# EAGLE design 406_led_jetracer_matrix (EAGLE 9.6.2)
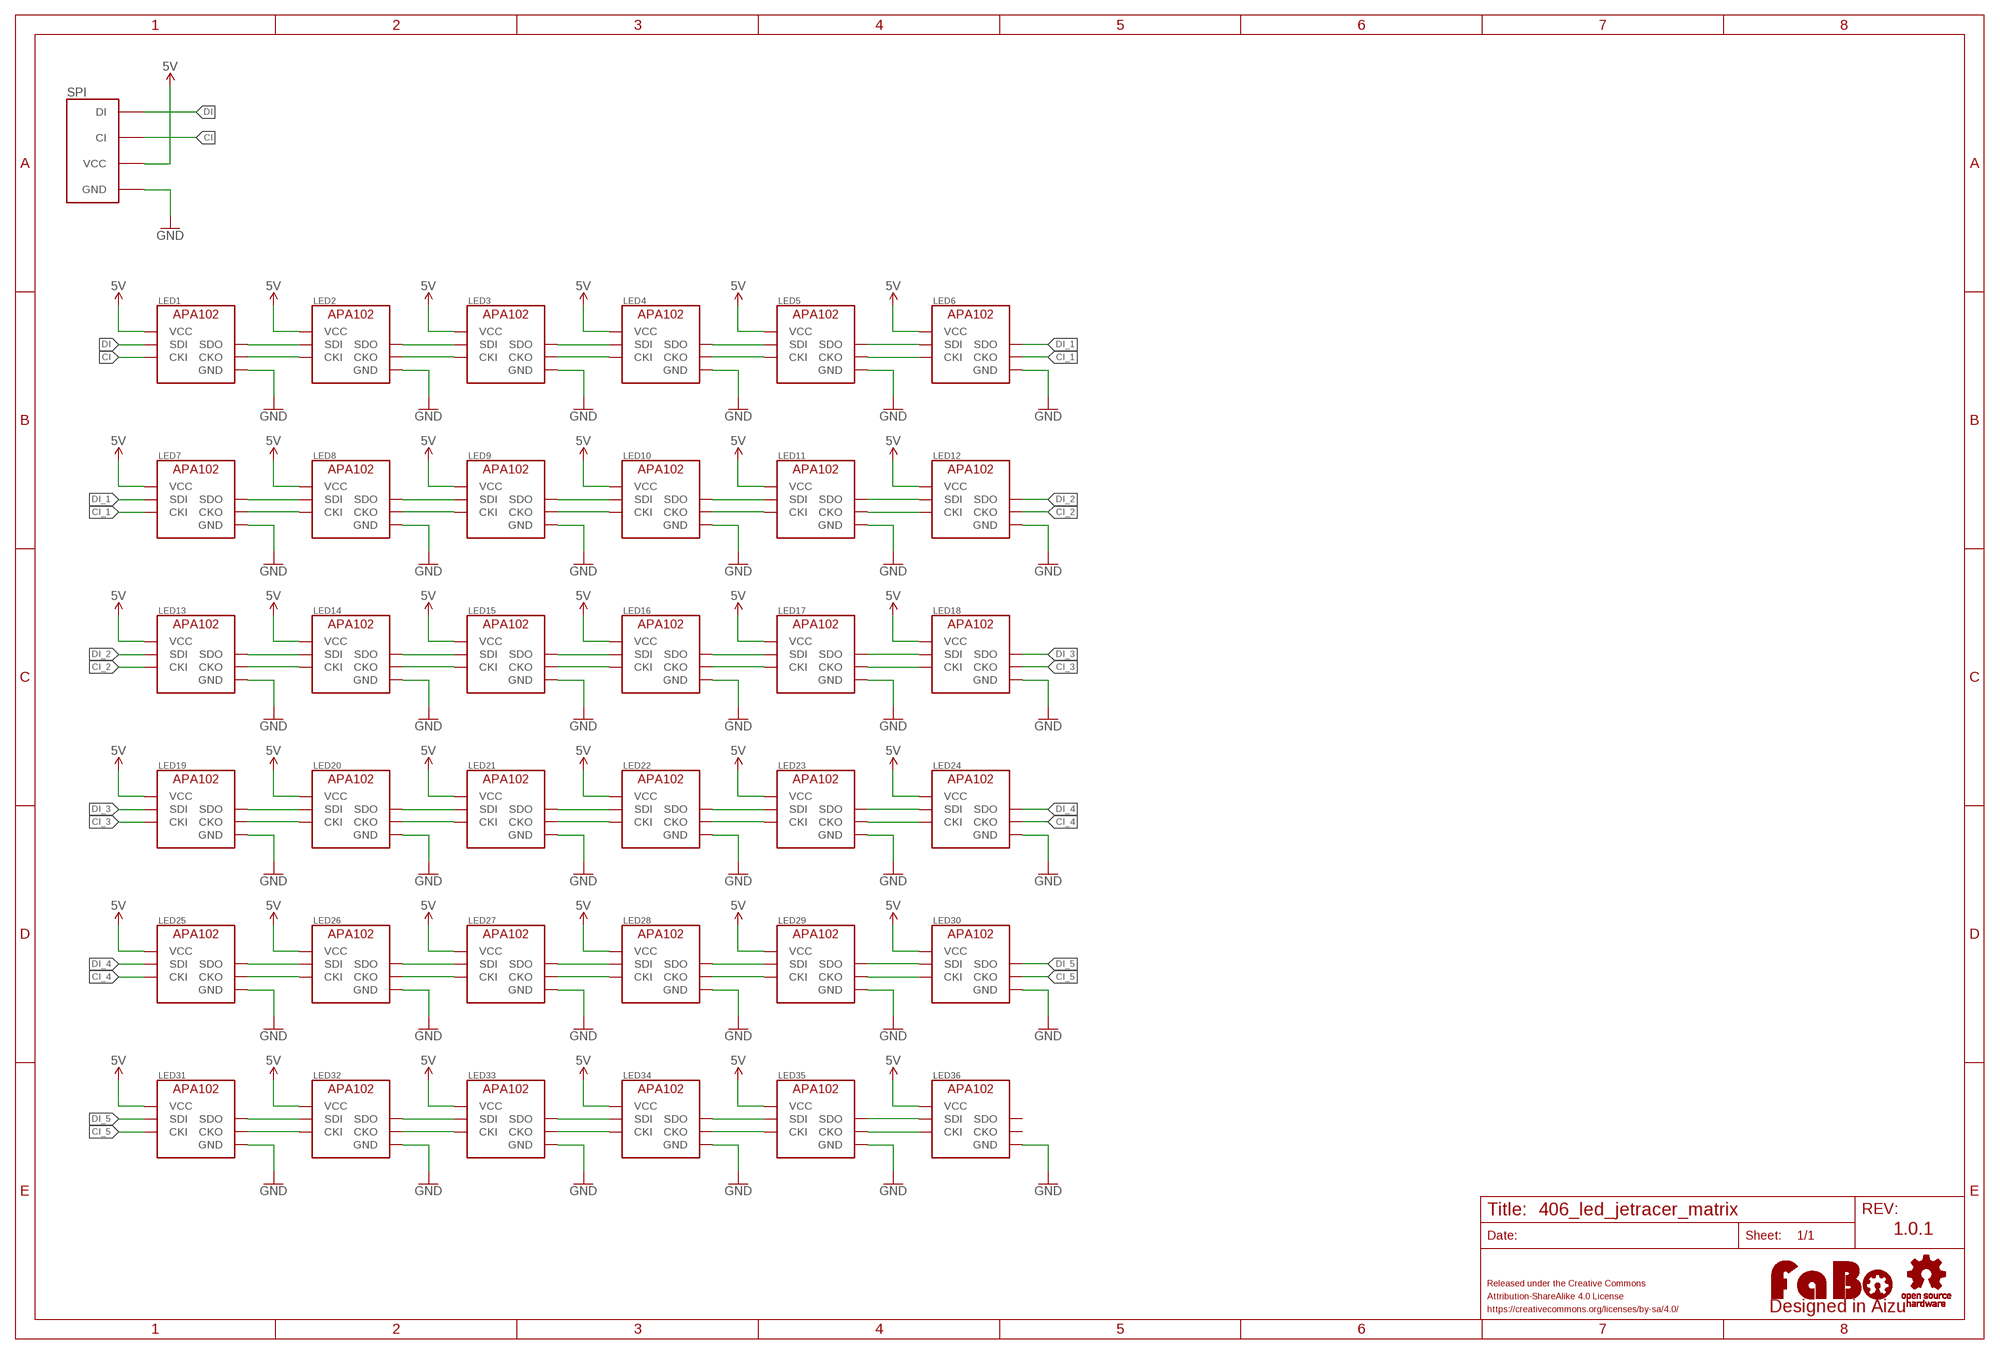
[diagram p0: schematic, sheet 1]

## Parts
LED1  APA102_IPIXEL  [APA102_2020]
LED2  APA102_IPIXEL  [APA102_2020]
LED3  APA102_IPIXEL  [APA102_2020]
LED4  APA102_IPIXEL  [APA102_2020]
LED5  APA102_IPIXEL  [APA102_2020]
LED6  APA102_IPIXEL  [APA102_2020]
LED7  APA102_IPIXEL  [APA102_2020]
LED8  APA102_IPIXEL  [APA102_2020]
LED9  APA102_IPIXEL  [APA102_2020]
LED10  APA102_IPIXEL  [APA102_2020]
LED11  APA102_IPIXEL  [APA102_2020]
LED12  APA102_IPIXEL  [APA102_2020]
LED13  APA102_IPIXEL  [APA102_2020]
LED14  APA102_IPIXEL  [APA102_2020]
LED15  APA102_IPIXEL  [APA102_2020]
LED16  APA102_IPIXEL  [APA102_2020]
LED17  APA102_IPIXEL  [APA102_2020]
LED18  APA102_IPIXEL  [APA102_2020]
LED19  APA102_IPIXEL  [APA102_2020]
LED20  APA102_IPIXEL  [APA102_2020]
LED21  APA102_IPIXEL  [APA102_2020]
LED22  APA102_IPIXEL  [APA102_2020]
LED23  APA102_IPIXEL  [APA102_2020]
LED24  APA102_IPIXEL  [APA102_2020]
LED25  APA102_IPIXEL  [APA102_2020]
LED26  APA102_IPIXEL  [APA102_2020]
LED27  APA102_IPIXEL  [APA102_2020]
LED28  APA102_IPIXEL  [APA102_2020]
LED29  APA102_IPIXEL  [APA102_2020]
LED30  APA102_IPIXEL  [APA102_2020]
LED31  APA102_IPIXEL  [APA102_2020]
LED32  APA102_IPIXEL  [APA102_2020]
LED33  APA102_IPIXEL  [APA102_2020]
LED34  APA102_IPIXEL  [APA102_2020]
LED35  APA102_IPIXEL  [APA102_2020]
LED36  APA102_IPIXEL  [APA102_2020]
LOGO1  LOGO_OSHW-M_BOTTOM  [LOGO_OSHW_M_BOTTOM]
LOGO2  LOGO_FABO-M_BOTTOM  [LOGO_FABO_M_BOTTOM]
SPI  FABO-SPI-LED-B04B-BOTTOM  [SPI-B04-PASK-1-BOTTOM]

## Nets
5V: LED1.VCC LED2.VCC LED3.VCC LED4.VCC LED5.VCC LED6.VCC LED7.VCC LED8.VCC LED9.VCC LED10.VCC LED11.VCC LED12.VCC LED13.VCC LED14.VCC LED15.VCC LED16.VCC LED17.VCC LED18.VCC LED19.VCC LED20.VCC LED21.VCC LED22.VCC LED23.VCC LED24.VCC LED25.VCC LED26.VCC LED27.VCC LED28.VCC LED29.VCC LED30.VCC LED31.VCC LED32.VCC LED33.VCC LED34.VCC LED35.VCC LED36.VCC SPI.VCC
CI: LED1.CKI SPI.CI
CI1: LED1.CKO LED2.CKI
CI2: LED2.CKO LED3.CKI
CI3: LED3.CKO LED4.CKI
CI4: LED4.CKO LED5.CKI
CI5: LED5.CKO LED6.CKI
CI6: LED11.CKO LED12.CKI
CI7: LED10.CKO LED11.CKI
CI8: LED9.CKO LED10.CKI
CI9: LED8.CKO LED9.CKI
CI10: LED7.CKO LED8.CKI
CI11: LED17.CKO LED18.CKI
CI12: LED16.CKO LED17.CKI
CI13: LED15.CKO LED16.CKI
CI14: LED14.CKO LED15.CKI
CI15: LED13.CKO LED14.CKI
CI16: LED23.CKO LED24.CKI
CI17: LED22.CKO LED23.CKI
CI18: LED21.CKO LED22.CKI
CI19: LED20.CKO LED21.CKI
CI20: LED19.CKO LED20.CKI
CI21: LED29.CKO LED30.CKI
CI22: LED28.CKO LED29.CKI
CI23: LED27.CKO LED28.CKI
CI24: LED26.CKO LED27.CKI
CI25: LED25.CKO LED26.CKI
CI26: LED35.CKO LED36.CKI
CI27: LED34.CKO LED35.CKI
CI28: LED33.CKO LED34.CKI
CI29: LED32.CKO LED33.CKI
CI30: LED31.CKO LED32.CKI
CI_1: LED6.CKO LED7.CKI
CI_2: LED12.CKO LED13.CKI
CI_3: LED18.CKO LED19.CKI
CI_4: LED24.CKO LED25.CKI
CI_5: LED30.CKO LED31.CKI
DI: LED1.SDI SPI.DI
DI1: LED1.SDO LED2.SDI
DI2: LED2.SDO LED3.SDI
DI3: LED3.SDO LED4.SDI
DI4: LED4.SDO LED5.SDI
DI5: LED5.SDO LED6.SDI
DI6: LED11.SDO LED12.SDI
DI7: LED10.SDO LED11.SDI
DI8: LED9.SDO LED10.SDI
DI9: LED8.SDO LED9.SDI
DI10: LED7.SDO LED8.SDI
DI11: LED17.SDO LED18.SDI
DI12: LED16.SDO LED17.SDI
DI13: LED15.SDO LED16.SDI
DI14: LED14.SDO LED15.SDI
DI15: LED13.SDO LED14.SDI
DI16: LED23.SDO LED24.SDI
DI17: LED22.SDO LED23.SDI
DI18: LED21.SDO LED22.SDI
DI19: LED20.SDO LED21.SDI
DI20: LED19.SDO LED20.SDI
DI21: LED29.SDO LED30.SDI
DI22: LED28.SDO LED29.SDI
DI23: LED27.SDO LED28.SDI
DI24: LED26.SDO LED27.SDI
DI25: LED25.SDO LED26.SDI
DI26: LED35.SDO LED36.SDI
DI27: LED34.SDO LED35.SDI
DI28: LED33.SDO LED34.SDI
DI29: LED32.SDO LED33.SDI
DI30: LED31.SDO LED32.SDI
DI_1: LED6.SDO LED7.SDI
DI_2: LED12.SDO LED13.SDI
DI_3: LED18.SDO LED19.SDI
DI_4: LED24.SDO LED25.SDI
DI_5: LED30.SDO LED31.SDI
GND: LED1.GND LED2.GND LED3.GND LED4.GND LED5.GND LED6.GND LED7.GND LED8.GND LED9.GND LED10.GND LED11.GND LED12.GND LED13.GND LED14.GND LED15.GND LED16.GND LED17.GND LED18.GND LED19.GND LED20.GND LED21.GND LED22.GND LED23.GND LED24.GND LED25.GND LED26.GND LED27.GND LED28.GND LED29.GND LED30.GND LED31.GND LED32.GND LED33.GND LED34.GND LED35.GND LED36.GND SPI.GND
Unconnected: LED36.CKO LED36.SDO

## Notes on the sheet
- 1.0.1

## Library data of the parts
LED1-LED36 = FaBo-LED:APA102
LOGO1 = FaBo-Logo:LOGO_OSHW
LOGO2 = FaBo-Logo:LOGO_FABO
SPI = FaBo-Connetor:FABO-SPI-LED

## Net classes
2 gnd: width 0.254 mm, drill 0.61 mm, clearance 0.254 mm
3 usbvcc: width 0.254 mm, drill 0.61 mm, clearance 0.254 mm
4 aref: width 0.254 mm, drill 0.61 mm, clearance 0.254 mm

## Board
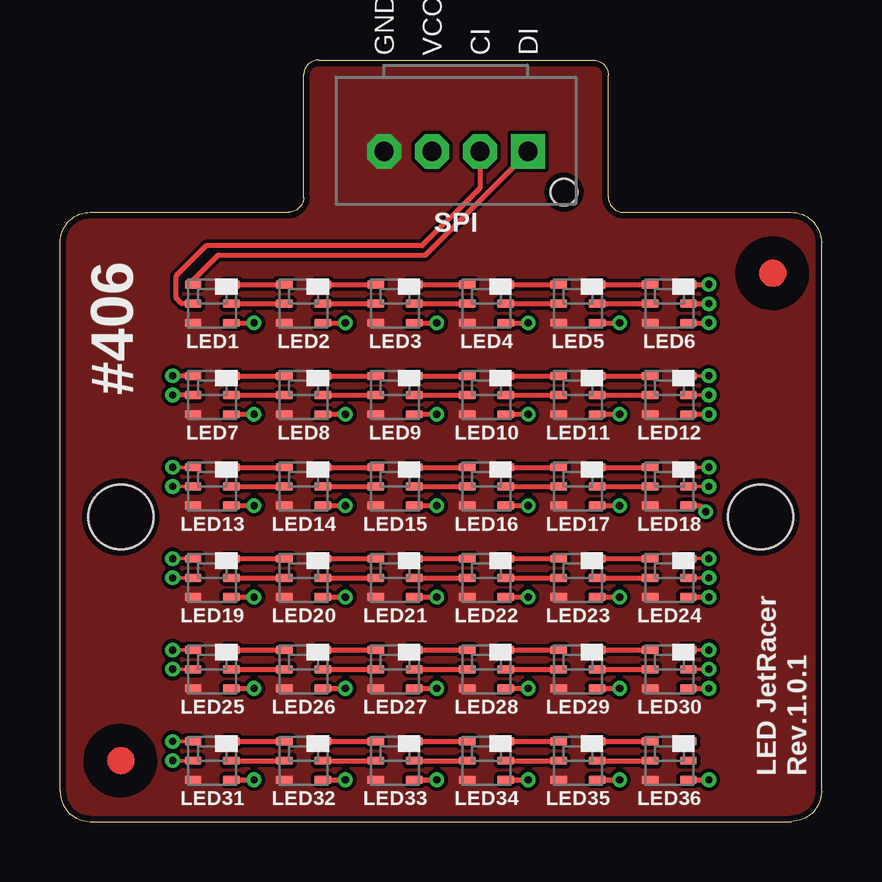
[diagram p1: board, top side]
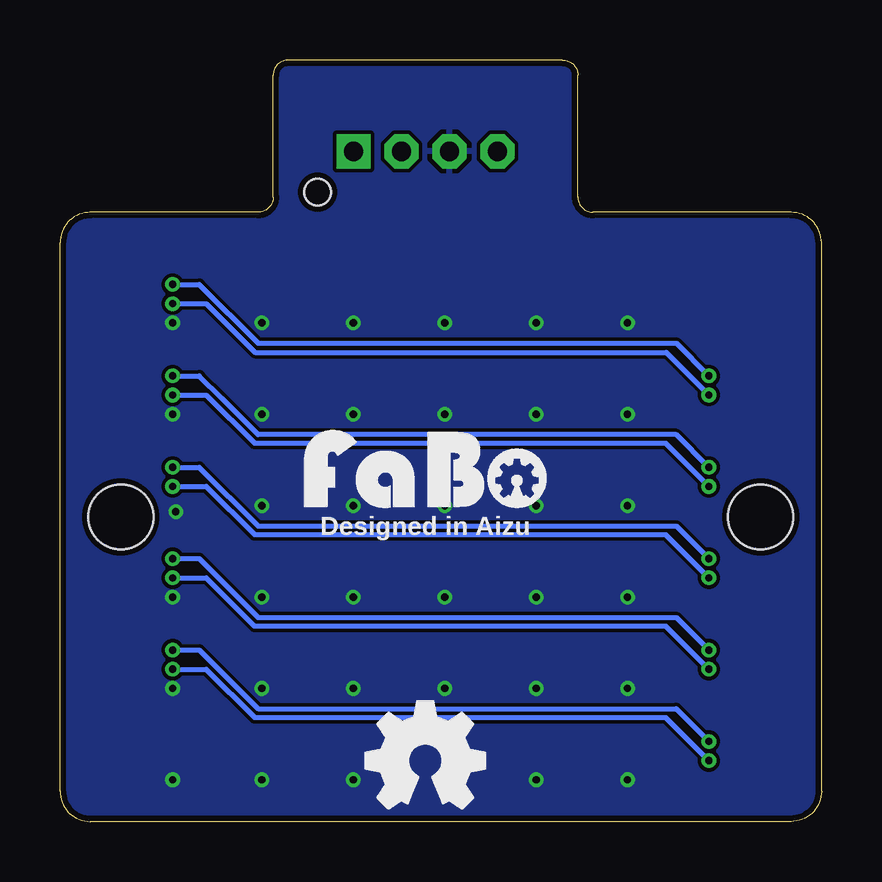
[diagram p2: board, bottom side, seen from below]

Size 31.75 x 31.75 mm. Coordinates in mm from the lower left corner, seen from the top.
Outline: 1.27,25.4 9.53,25.4 arc90 10.16,26.04 10.16,31.11 arc-90 10.79,31.75 22.23,31.75 arc-90 22.86,31.11 22.86,26.04 arc90 23.5,25.4 30.48,25.4 arc-90 31.75,24.13 31.75,1.27 arc-90 30.48,0 1.27,0 arc-90 0,1.27 0,24.13 arc-90 1.27,25.4
Copper layers (1*16): Top 0.035mm / dielectric 1.6mm / Bottom 0.035mm
Design rules "PCBway": minimum track width 6mil, minimum drill 12mil, track to track 6mil, track to pad 6mil, pad to pad 6mil, via to via 6mil, smd to smd 6mil, copper to edge 10mil, drill to drill 10mil, minimum pad ring 10mil, minimum via ring 6mil, stop-mask expansion 2mil, vias tented up to drill 100mil, thermal gap 8mil
Holes 2.7 mm at 2.54,12.7 29.21,12.7

### Footprints (pad centres in the part's own frame; a part is rotated, then mirrored left to right if it is on the bottom)
APA102_2020 = smd 0.7 x 0.35: CKI 0.8,0; CKO -0.8,0; GND 0.8,0.8; SDI 0.8,-0.8; SDO -0.8,-0.8; VCC -0.8,0.8
SPI-B04-PASK-1-BOTTOM = drill 0.8 pad 1.422 octagon: CI -1,0; GND 3,0; VCC 1,0 | drill 0.8 pad 1.422 square: DI -3,0 | hole 1.1: -4.5,1.7

### Placement (x,y rotation side)
LED1  6.35,21.59 180 top
LED2  10.16,21.59 180 top
LED3  13.97,21.59 180 top
LED4  17.78,21.59 180 top
LED5  21.59,21.59 180 top
LED6  25.4,21.59 180 top
LED7  6.35,17.78 180 top
LED8  10.16,17.78 180 top
LED9  13.97,17.78 180 top
LED10  17.78,17.78 180 top
LED11  21.59,17.78 180 top
LED12  25.4,17.78 180 top
LED13  6.35,13.97 180 top
LED14  10.16,13.97 180 top
LED15  13.97,13.97 180 top
LED16  17.78,13.97 180 top
LED17  21.59,13.97 180 top
LED18  25.4,13.97 180 top
LED19  6.35,10.16 180 top
LED20  10.16,10.16 180 top
LED21  13.97,10.16 180 top
LED22  17.78,10.16 180 top
LED23  21.59,10.16 180 top
LED24  25.4,10.16 180 top
LED25  6.35,6.35 180 top
LED26  10.16,6.35 180 top
LED27  13.97,6.35 180 top
LED28  17.78,6.35 180 top
LED29  21.59,6.35 180 top
LED30  25.4,6.35 180 top
LED31  6.35,2.54 180 top
LED32  10.16,2.54 180 top
LED33  13.97,2.54 180 top
LED34  17.78,2.54 180 top
LED35  21.59,2.54 180 top
LED36  25.4,2.54 180 top
LOGO1  16.51,2.54 0 top
LOGO2  16.51,12.7 0 top
SPI  16.51,27.94 180 top
U$2  [MARK_POINT_3MM]  29.72,22.86 0 top
U$3  [MARK_POINT_3MM]  2.54,2.54 0 top

### Tracks (layer width: path | path; a pad name or v marks a point on that pad's centre or on a via)
5V  (via drill 0.3)
  Top 0.203: LED1.VCC v8.09,20.79 | LED2.VCC v11.9,20.79 | LED3.VCC v15.71,20.79 | LED4.VCC v19.52,20.79 | LED5.VCC v23.33,20.79 | LED7.VCC v8.09,16.98 | LED8.VCC v11.9,16.98 | LED9.VCC v15.71,16.98 | LED10.VCC v19.52,16.98 | LED11.VCC v23.33,16.98 | LED12.VCC v27.05,16.98 | LED13.VCC v8.09,13.17 | LED14.VCC v11.9,13.17 | LED15.VCC v15.71,13.17 | LED16.VCC v19.52,13.17 | LED17.VCC v23.33,13.17 | LED19.VCC v8.09,9.36 | LED20.VCC v11.9,9.36 | LED21.VCC v15.71,9.36 | LED22.VCC v19.52,9.36 | LED23.VCC v23.33,9.36 | LED24.VCC v27.05,9.36 | LED25.VCC v8.09,5.55 | LED26.VCC v11.9,5.55 | LED27.VCC v15.71,5.55 | LED28.VCC v19.52,5.55 | LED29.VCC v23.33,5.55 | LED30.VCC v27.05,5.55 | LED31.VCC v8.09,1.74 | LED32.VCC v11.9,1.74 | LED33.VCC v15.71,1.74 | LED34.VCC v19.52,1.74 | LED35.VCC v23.33,1.74 | LED36.VCC v27.05,1.74 | LED18.VCC 26.67,13.17 v26.92,12.92 | LED6.VCC v27.05,20.79
  pour Bottom (isolate 0.152, rank 3): 0,0 0,31.75 31.75,31.75 31.75,0
CI
  Top 0.203: SPI.CI 17.51,26.42 15.1,24 6.1,24 4.83,22.73 4.83,21.84 5.08,21.59 LED1.CKI
CI1
  Top 0.203: LED1.CKO LED2.CKI
CI2
  Top 0.203: LED2.CKO LED3.CKI
CI3
  Top 0.203: LED3.CKO LED4.CKI
CI4
  Top 0.203: LED4.CKO LED5.CKI
CI5
  Top 0.203: LED5.CKO LED6.CKI
CI6
  Top 0.203: LED11.CKO LED12.CKI
CI7
  Top 0.203: LED10.CKO LED11.CKI
CI8
  Top 0.203: LED9.CKO LED10.CKI
CI9
  Top 0.203: LED8.CKO LED9.CKI
CI10
  Top 0.203: LED7.CKO LED8.CKI
CI11
  Top 0.203: LED17.CKO LED18.CKI
CI12
  Top 0.203: LED16.CKO LED17.CKI
CI13
  Top 0.203: LED15.CKO LED16.CKI
CI14
  Top 0.203: LED14.CKO LED15.CKI
CI15
  Top 0.203: LED13.CKO LED14.CKI
CI16
  Top 0.203: LED23.CKO LED24.CKI
CI17
  Top 0.203: LED22.CKO LED23.CKI
CI18
  Top 0.203: LED21.CKO LED22.CKI
CI19
  Top 0.203: LED20.CKO LED21.CKI
CI20
  Top 0.203: LED19.CKO LED20.CKI
CI21
  Top 0.203: LED29.CKO LED30.CKI
CI22
  Top 0.203: LED28.CKO LED29.CKI
CI23
  Top 0.203: LED27.CKO LED28.CKI
CI24
  Top 0.203: LED26.CKO LED27.CKI
CI25
  Top 0.203: LED25.CKO LED26.CKI
CI26
  Top 0.203: LED35.CKO LED36.CKI
CI27
  Top 0.203: LED34.CKO LED35.CKI
CI28
  Top 0.203: LED33.CKO LED34.CKI
CI29
  Top 0.203: LED32.CKO LED33.CKI
CI30
  Top 0.203: LED31.CKO LED32.CKI
CI_1  (via drill 0.3)
  Top 0.203: LED6.CKO v27.05,21.59 | LED7.CKI v4.7,17.78
  Bottom 0.203: v4.7,17.78 6.48,19.56 23.62,19.56 25.65,21.59 v27.05,21.59
CI_2  (via drill 0.3)
  Top 0.152: LED12.CKO v27.05,17.78 | LED13.CKI v4.7,13.97
  Bottom 0.203: v4.7,13.97 6.5,15.77 23.64,15.77 25.65,17.78 v27.05,17.78
CI_3  (via drill 0.3)
  Top 0.152: LED18.CKO v27.05,13.97 | LED19.CKI v4.7,10.16
  Bottom 0.203: v4.7,10.16 6.5,11.96 23.64,11.96 25.65,13.97 v27.05,13.97
CI_4  (via drill 0.3)
  Top 0.152: LED24.CKO v27.05,10.16 | LED25.CKI v4.7,6.35
  Bottom 0.203: v4.7,6.35 6.5,8.15 23.65,8.15 25.65,10.16 v27.05,10.16
CI_5  (via drill 0.3)
  Top 0.152: LED30.CKO v27.05,6.35 | LED31.CKI v4.7,2.54
  Bottom 0.203: v4.7,2.54 6.5,4.34 23.64,4.34 25.65,6.35 v27.05,6.35
DI
  Top 0.203: SPI.DI 19.51,27.89 15.24,23.62 6.6,23.62 5.55,22.57 LED1.SDI
DI1
  Top 0.203: LED1.SDO LED2.SDI
DI2
  Top 0.203: LED2.SDO LED3.SDI
DI3
  Top 0.203: LED3.SDO LED4.SDI
DI4
  Top 0.203: LED4.SDO LED5.SDI
DI5
  Top 0.203: LED5.SDO LED6.SDI
DI6
  Top 0.203: LED11.SDO LED12.SDI
DI7
  Top 0.203: LED10.SDO LED11.SDI
DI8
  Top 0.203: LED9.SDO LED10.SDI
DI9
  Top 0.203: LED8.SDO LED9.SDI
DI10
  Top 0.203: LED7.SDO LED8.SDI
DI11
  Top 0.203: LED17.SDO LED18.SDI
DI12
  Top 0.203: LED16.SDO LED17.SDI
DI13
  Top 0.203: LED15.SDO LED16.SDI
DI14
  Top 0.203: LED14.SDO LED15.SDI
DI15
  Top 0.203: LED13.SDO LED14.SDI
DI16
  Top 0.203: LED23.SDO LED24.SDI
DI17
  Top 0.203: LED22.SDO LED23.SDI
DI18
  Top 0.203: LED21.SDO LED22.SDI
DI19
  Top 0.203: LED20.SDO LED21.SDI
DI20
  Top 0.203: LED19.SDO LED20.SDI
DI21
  Top 0.203: LED29.SDO LED30.SDI
DI22
  Top 0.203: LED28.SDO LED29.SDI
DI23
  Top 0.203: LED27.SDO LED28.SDI
DI24
  Top 0.203: LED26.SDO LED27.SDI
DI25
  Top 0.203: LED25.SDO LED26.SDI
DI26
  Top 0.203: LED35.SDO LED36.SDI
DI27
  Top 0.203: LED34.SDO LED35.SDI
DI28
  Top 0.203: LED33.SDO LED34.SDI
DI29
  Top 0.203: LED32.SDO LED33.SDI
DI30
  Top 0.203: LED31.SDO LED32.SDI
DI_1  (via drill 0.3)
  Top 0.203: LED6.SDO v27.05,22.39 | LED7.SDI v4.7,18.58
  Bottom 0.203: v4.7,18.58 6.06,19.94 23.5,19.94 25.95,22.39 v27.05,22.39
DI_2  (via drill 0.3)
  Top 0.152: LED12.SDO v27.05,18.58 | LED13.SDI v4.7,14.77
  Bottom 0.203: v4.7,14.77 6.06,16.13 23.5,16.13 24.96,17.59 25.02,17.65 25.95,18.58 v27.05,18.58
DI_3  (via drill 0.3)
  Top 0.152: LED18.SDO v27.05,14.77 | LED19.SDI v4.7,10.96
  Bottom 0.203: v4.7,10.96 6.06,12.32 23.5,12.32 25.95,14.77 v27.05,14.77
DI_4  (via drill 0.3)
  Top 0.152: LED24.SDO v27.05,10.96 | LED25.SDI v4.7,7.15
  Bottom 0.203: v4.7,7.15 6.06,8.51 23.5,8.51 25.95,10.96 v27.05,10.96
DI_5  (via drill 0.3)
  Top 0.152: LED30.SDO v27.05,7.15 | LED31.SDI v4.7,3.34
  Bottom 0.203: v4.7,3.34 6.06,4.7 23.5,4.7 25.95,7.15 v27.05,7.15
GND
  pour Top (isolate 0.152, rank 3, no thermals): 0,0 0,31.75 31.75,31.75 31.75,0

### Text on the board
tPlace: #406 | LED JetRacer | Rev.1.0.1
bPlace: Designed in Aizu